# Altium schematic sheet PGS_3.SchDoc
size 381 x 241 mm; SheetNumber: 1; SheetTotal: 2
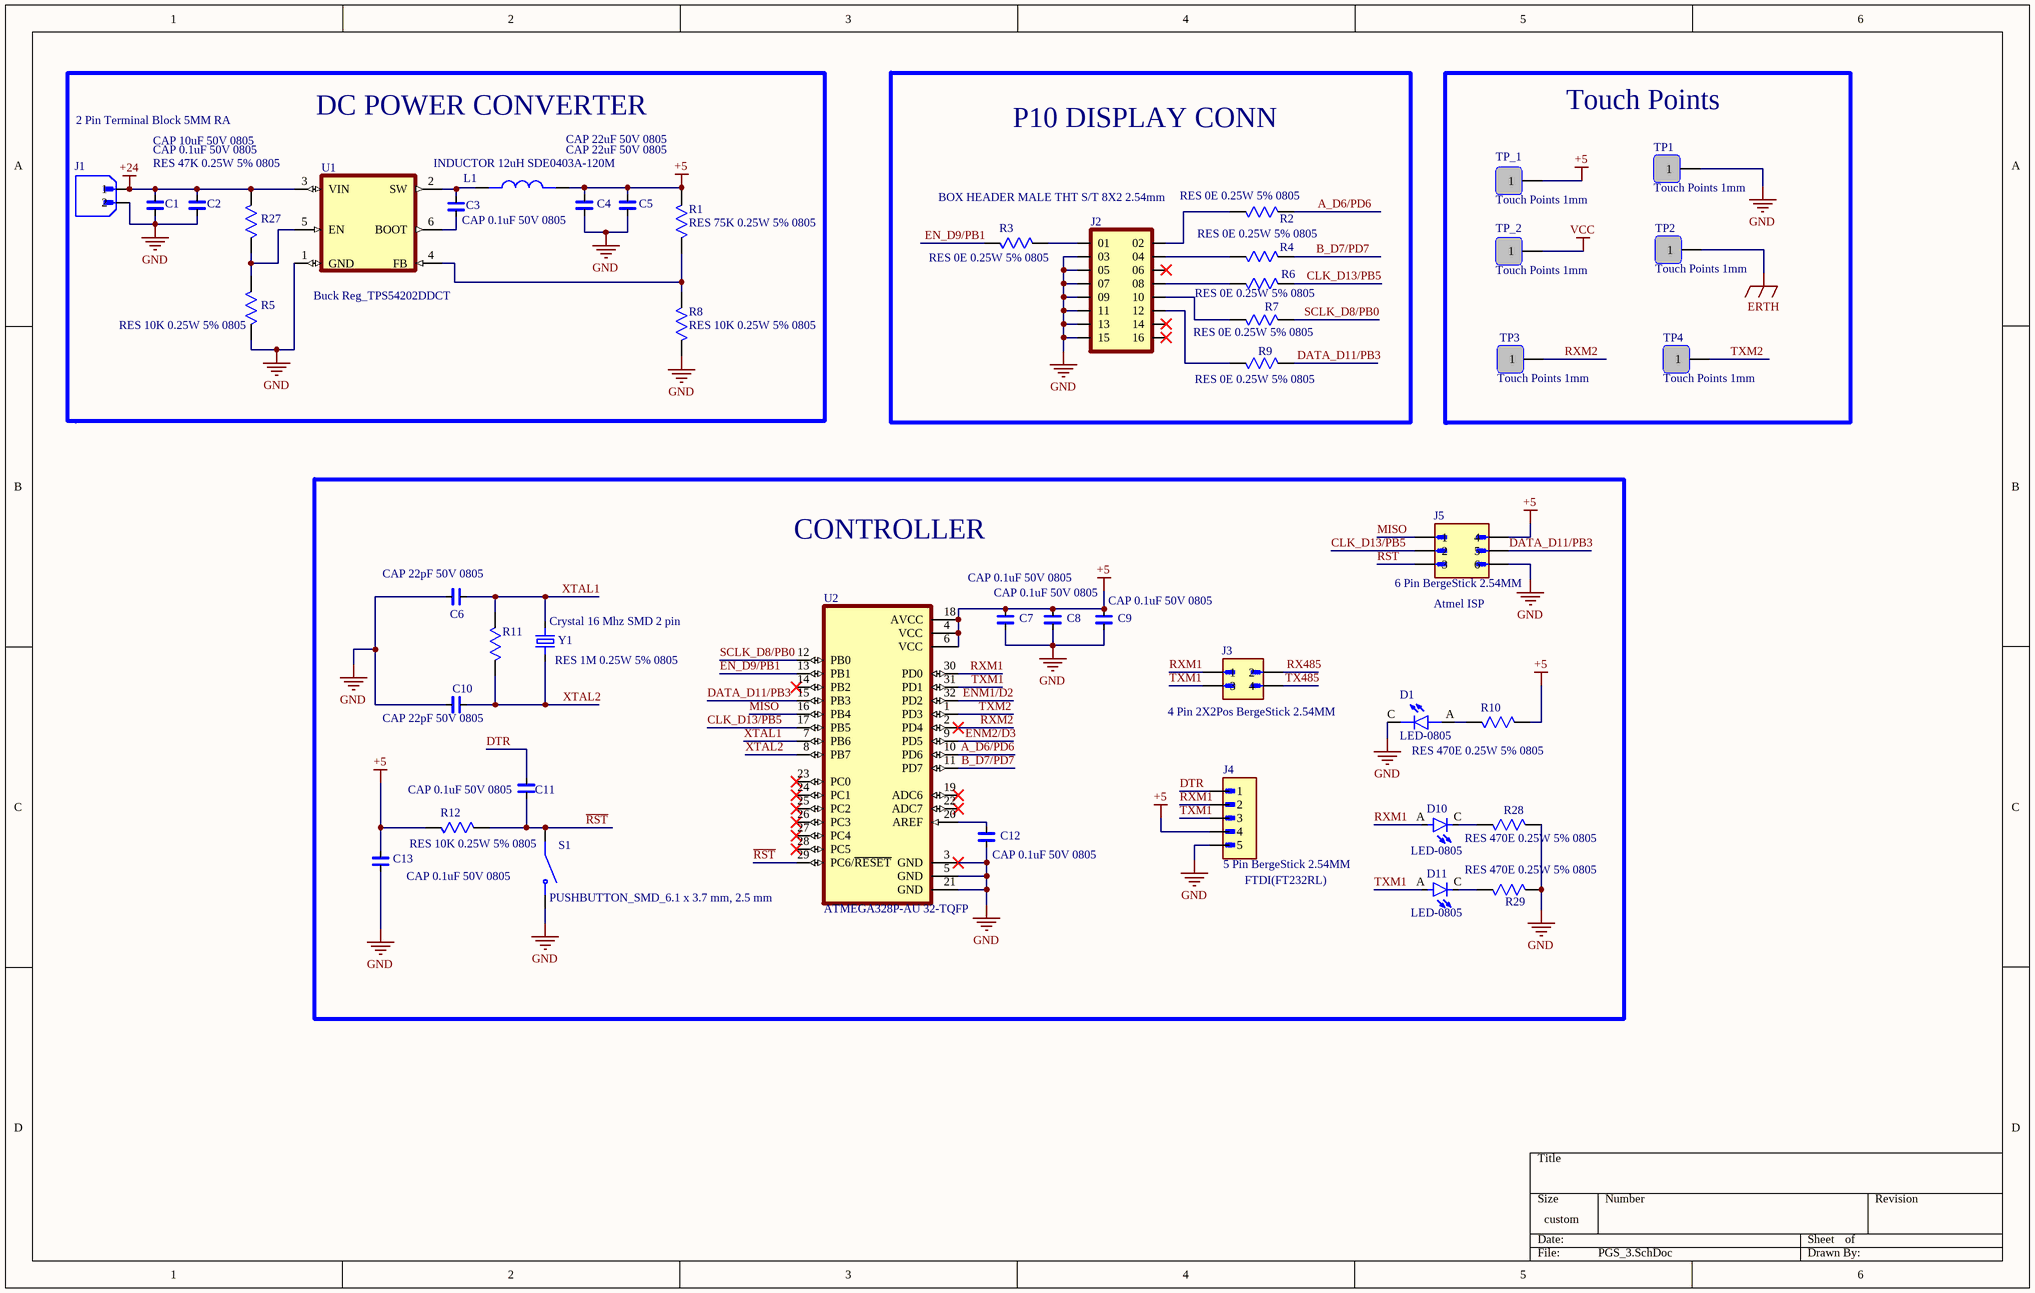
[diagram p0: PGS_3.SchDoc]

## Parts
C1  CAP 10uF 50V 0805  [CAP CER 0.1uF/50V 5%]
C2  CAP 0.1uF 50V 0805  [CAP CER 0.1uF/50V 5%]
C3  CAP 0.1uF 50V 0805  [CAP CER 0.1uF/50V 5%]
C4  CAP 22uF 50V 0805  [CAP CER 0.1uF/50V 5%]
C5  CAP 22uF 50V 0805  [CAP CER 0.1uF/50V 5%]
C6  CAP 22pF 50V 0805  [CAP CER 0.1uF/50V 5%]
C7  CAP 0.1uF 50V 0805  [CAP CER 0.1uF/50V 5%]
C8  CAP 0.1uF 50V 0805  [CAP CER 0.1uF/50V 5%]
C9  CAP 0.1uF 50V 0805  [CAP CER 0.1uF/50V 5%]
C10  CAP 22pF 50V 0805  [CAP CER 0.1uF/50V 5%]
C11  CAP 0.1uF 50V 0805  [CAP CER 0.1uF/50V 5%]
C12  CAP 0.1uF 50V 0805  [CAP CER 0.1uF/50V 5%]
C13  CAP 0.1uF 50V 0805  [CAP CER 0.1uF/50V 5%]
D1  LED-0805  [LED-0805]
D10  LED-0805  [LED-0805]
D11  LED-0805  [LED-0805]
J1  2 Pin Terminal Block 5MM RA  [2 Pin Terminal Block 5MM RA]
J2  BOX HEADER MALE THT S/T 8X2 2.54mm  [BOX HEADER MALE 8X2 2.54mm]
J3  4 Pin 2X2Pos BergeStick 2.54MM  [4 Pin BergeStick 2.54MM]
J4  5 Pin BergeStick 2.54MM  [5 Pin BergeStick 2.54MM]
J5  6 Pin BergeStick 2.54MM  [6 Pin BergeStick 2.54MM - duplicate]
L1  INDUCTOR 12uH SDE0403A-120M  [INDUCTOR 12uH SDE0403A-120M]
R1  RES 75K 0.25W 5% 0805  [RES 0805 10K/0.25W 5%]
R2  RES 0E 0.25W 5% 0805  [RES 0805 10K/0.25W 5%]
R3  RES 0E 0.25W 5% 0805  [RES 0805 10K/0.25W 5%]
R4  RES 0E 0.25W 5% 0805  [RES 0805 10K/0.25W 5%]
R5  RES 10K 0.25W 5% 0805  [RES 0805 10K/0.25W 5%]
R6  RES 0E 0.25W 5% 0805  [RES 0805 10K/0.25W 5%]
R7  RES 0E 0.25W 5% 0805  [RES 0805 10K/0.25W 5%]
R8  RES 10K 0.25W 5% 0805  [RES 0805 10K/0.25W 5%]
R9  RES 0E 0.25W 5% 0805  [RES 0805 10K/0.25W 5%]
R10  RES 470E 0.25W 5% 0805  [RES 0805 10K/0.25W 5%]
R11  RES 1M 0.25W 5% 0805  [RES 0805 10K/0.25W 5%]
R12  RES 10K 0.25W 5% 0805  [RES 0805 10K/0.25W 5%]
R27  RES 47K 0.25W 5% 0805  [RES 0805 10K/0.25W 5%]
R28  RES 470E 0.25W 5% 0805  [RES 0805 10K/0.25W 5%]
R29  RES 470E 0.25W 5% 0805  [RES 0805 10K/0.25W 5%]
S1  PUSHBUTTON_SMD_6.1 x 3.7 mm, 2.5 mm  [PUSHBUTTON_SMD_6.1 x 3.7 mm, 2.5 mm]
TP1  Touch Points 1mm  [Touch Points 1mm]
TP2  Touch Points 1mm  [Touch Points 1mm]
TP3  Touch Points 1mm  [Touch Points 1mm]
TP4  Touch Points 1mm  [Touch Points 1mm]
TP_1  Touch Points 1mm  [Touch Points 1mm]
TP_2  Touch Points 1mm  [Touch Points 1mm]
U1  Buck Reg_TPS54202DDCT  [Buck Reg_TPS54202DDCT]
U2  ATMEGA328P-AU 32-TQFP  [ATMEGA328P-AU 32-TQFP]
Y1  Crystal 16 Mhz SMD 2 pin  [Crystal 16 Mhz SMD 2 pin]

## Blocks framed on the sheet
DC POWER CONVERTER: C1-C5 J1 L1 R1 R5 R8 R27 U1
P10 DISPLAY CONN: J2 R2-R4 R6 R7 R9
Touch Points: TP1-TP4 TP_1 TP_2
CONTROLLER: C6-C13 D1 D10 D11 J3-J5 R10-R12 R28 R29 S1 U2 Y1

## Nets
+5: C4.2 C5.2 C7.2 C8.2 C9.2 C13.2 J4.4 J5.4 L1.2 R1.2 R10.2 R12.1 TP_1.1 U2.4(VCC) U2.6(VCC) U2.18(AVCC)
+24: C1.2 C2.2 J1.1 R27.2 U1.3(VIN)
ERTH: TP2.1
GND: C1.1 C2.1 C4.1 C5.1 C6.1 C7.1 C8.1 C9.1 C10.1 C12.1 C13.1 D1.C J1.2 J2.03 J2.05 J2.07 J2.09 J2.11 J2.13 J2.15 J4.5 J5.6 R5.1 R8.1 R28.2 R29.2 S1.2 TP1.1 U1.1(GND) U2.3(GND) U2.5(GND) U2.21(GND)
VCC: TP_2.1
A_D6/PD6: R2.2 U2.10(PD6)
B_D7/PD7: R4.2 U2.11(PD7)
CLK_D13/PB5: J5.2 R6.2 U2.17(PB5)
DATA_D11/PB3: J5.5 R9.2 U2.15(PB3)
DTR: C11.2 J4.1
EN_D9/PB1: R3.1 U2.13(PB1)
ENM1/D2: U2.32(PD2)
ENM2/D3: U2.9(PD5)
MISO: J5.1 U2.16(PB4)
~{RST}: C11.1 J5.3 R12.2 S1.1 U2.29(PC6/~{RESET})
RX485: J3.2
RXM1: D10.A J3.1 J4.2 U2.30(PD0)
RXM2: TP3.1 U2.2(PD4)
SCLK_D8/PB0: R7.2 U2.12(PB0)
TX485: J3.4
TXM1: D11.A J3.3 J4.3 U2.31(PD1)
TXM2: TP4.1 U2.1(PD3)
XTAL1: C6.2 R11.2 U2.7(PB6) Y1.2
XTAL2: C10.2 R11.1 U2.8(PB7) Y1.1
NetC3_1: C3.1 U1.6(BOOT)
NetC3_2: C3.2 L1.1 U1.2(SW)
NetC12_2: C12.2 U2.20(AREF)
NetD1_A: D1.A R10.1
NetD10_C: D10.C R28.1
NetD11_C: D11.C R29.1
NetJ2_01: J2.01 R3.2
NetJ2_02: J2.02 R2.1
NetJ2_04: J2.04 R4.1
NetJ2_08: J2.08 R6.1
NetJ2_10: J2.10 R7.1
NetJ2_12: J2.12 R9.1
NetR1_1: R1.1 R8.2 U1.4(FB)
NetR5_2: R5.2 R27.1 U1.5(EN)

Not connected (* = marked no-connect by the designer): J2 06* 14* 16*; U2 14(PB2)* 19(ADC6)* 22(ADC7)* 23(PC0)* 24(PC1)* 25(PC2)* 26(PC3)* 27(PC4)* 28(PC5)*

## Notes on the sheet
- (near J5) Atmel ISP
- (near J4) FTDI(FT232RL)

## Library data of the parts
C1-C13 = CAP CER 0.1uF/50V 5%: CAP CER 0.1uF/50V  Ceramic Capacitor X7R 0805 (2012 Metric); MF: Samsung; MP: CL21B104KCFNNNE; Purchase-URL: https://pricing.snapeda.com/search?q=CL21B104KCFNNNE&ref=eda; Package: 0805 Samsung; Check_prices: https://www.snapeda.com/parts/CL21B104KCFNNNE/Samsung+Electro-Mechanics/view-part/?ref=eda; Value: *; SnapEDA_Link: https://www.snapeda.com/parts/CL21B104KCFNNNE/Samsung+Electro-Mechanics/view-part/?ref=snap; Digi-Key_Part_Number: 1276-6840-2-ND
D1 = LED-0805: Red 640nm LED Indication - Discrete 1.85V 0805 (2012 Metric) APT2012SRCPRV; MF: Kingbright; SnapEDA_Link: https://www.snapeda.com/parts/APT2012SRCPRV/Kingbright/view-part/?ref=snap; Package: 0805 Kingbright; Value: *; MP: APT2012SRCPRV; Check_prices: https://www.snapeda.com/parts/APT2012SRCPRV/Kingbright/view-part/?ref=eda
D10 D11 = LED-0805: Red 640nm LED Indication - Discrete 1.85V 0805 (2012 Metric) SMT APT2012SRCPRV; MF: Kingbright; SnapEDA_Link: https://www.snapeda.com/parts/APT2012SRCPRV/Kingbright/view-part/?ref=snap; Package: 0805 Kingbright; Value: *; MP: APT2012SRCPRV; Check_prices: https://www.snapeda.com/parts/APT2012SRCPRV/Kingbright/view-part/?ref=eda
J1 = 2 Pin Terminal Block 5MM RA: 2 Pin Terminal Block HDR 5MM THT RA _OQ0271510000G; MF: Amphenol Anytek; SnapEDA_Link: https://www.snapeda.com/parts/OQ0271510000G/Amphenol/view-part/?ref=snap; Package: None; Value: *; MP: OQ0271510000G; Check_prices: https://www.snapeda.com/parts/OQ0271510000G/Amphenol/view-part/?ref=eda
J2 = BOX HEADER MALE THT S/T 8X2 2.54mm: THT BOX HEADER MALE S/T 8X2 2.54mm 16 pin; MP: TSS-108-01-T-D; Availability: Unavailable; Value: *; Price: None; Package: None
J3 = 4 Pin 2X2Pos BergeStick 2.54MM: 4 Pin 2X2Pos THT S/T BergeStick 2.54MM Amphenol 67997-104HLF 3A; MF: Amphenol ICC; Value: *; Package: None; Purchase-URL: https://pricing.snapeda.com/search/part/67997-104HLF/?ref=eda; Digi-Key_Part_Number: 609-3225-ND; Check_prices: https://www.snapeda.com/parts/67997-104HLF/Amphenol+FCI/view-part/?ref=eda; MP: 67997-104HLF; SnapEDA_Link: https://www.snapeda.com/parts/67997-104HLF/Amphenol+FCI/view-part/?ref=snap
J4 = 5 Pin BergeStick 2.54MM: 5 Pin 5Pos THT S/T BergeStick 2.54MM Amphenol68002-405HLF 3A; Package: None; Price: None; Value: *; MP: 68002-405HLF; Availability: Unavailable
J5 = 6 Pin BergeStick 2.54MM_1: 6 Pin 3X3Pos THT S/T BergeStick 2.54MM Amphenol 69192-406HLF; MF: AMPHENOL ICC / FCI; Package: None; Digi-Key_Part_Number: 609-4711-ND; Check_prices: https://www.snapeda.com/parts/69192-406HLF/Amphenol/view-part/?ref=eda; Value: *; MP: 69192-406HLF; Purchase-URL: https://pricing.snapeda.com/search/part/69192-406HLF/?ref=eda; SnapEDA_Link: https://www.snapeda.com/parts/69192-406HLF/Amphenol/view-part/?ref=snap
L1 = INDUCTOR 12uH SDE0403A-120M: INDUCTOR_2020(5.5mmX4.5mm)  SMT INDUCTOR 12uH SDE0403A-120M0 LQH5BPB4R7NT0L; Package: None; Price: None; Value: *; MP: LQH5BPB4R7NT0L; Availability: Unavailable
R1-R12 R27 = RES 10K 0.25W 5% 0805: RESISTOR, THICK FILM, 10K, 5%, 0805 0.25W; MP: ERJ-6GEYJ103V; MF: Panasonic Electronic; Price: None; Check_prices: https://www.snapeda.com/parts/ERJ-6GEYJ103V/Panasonic+Electronic+Components/view-part/?ref=eda; Package: 805-2 Panasonic; Purchase-URL: https://pricing.snapeda.com/search/part/ERJ-6GEYJ103V/?ref=eda; Availability: In Stock; SnapEDA_Link: https://www.snapeda.com/parts/ERJ-6GEYJ103V/Panasonic+Electronic+Components/view-part/?ref=snap; Value: *
R28 R29 = RES 10K 0.25W 5% 0805: RESISTOR, THICK FILM, 10K, 5%, 0805 0.25W SMT; MP: ERJ-6GEYJ103V; MF: Panasonic Electronic; Price: None; Check_prices: https://www.snapeda.com/parts/ERJ-6GEYJ103V/Panasonic+Electronic+Components/view-part/?ref=eda; Package: 805-2 Panasonic; Purchase-URL: https://pricing.snapeda.com/search/part/ERJ-6GEYJ103V/?ref=eda; Availability: In Stock; SnapEDA_Link: https://www.snapeda.com/parts/ERJ-6GEYJ103V/Panasonic+Electronic+Components/view-part/?ref=snap; Value: *
S1 = PUSHBUTTON_SMD_6.1 x 3.7 mm, 2.5 mm: 6.1 x 3.7 mm, 2.5 mm Actuator Height, 260 gf, Red, Surface Mount, SPST, Tactile Switch, TS09-63-25-R-260-SMT-TR; MF: Same Sky; SnapEDA_Link: https://www.snapeda.com/parts/TS09-63-25-R-260-SMT-TR/Same+Sky/view-part/?ref=snap; Package: None; Value: *; MP: TS09-63-25-R-260-SMT-TR; Check_prices: https://www.snapeda.com/parts/TS09-63-25-R-260-SMT-TR/Same+Sky/view-part/?ref=eda
TP1-TP4 TP_1 TP_2 = Touch Points: Touch Points 0.75mm to1mm
U1 = TPS54202DDCT: 4.5V to 28V Input, 2A Output, EMI Friendly Synchronous Step-Down Converter TPS54202DDCT; MF: Texas Instruments; SnapEDA_Link: https://www.snapeda.com/parts/TPS54202DDCT/Texas+Instruments/view-part/?ref=snap; Package: SOT-23-THN-6 Texas Instruments; Value: *; MP: TPS54202DDCT; Check_prices: https://www.snapeda.com/parts/TPS54202DDCT/Texas+Instruments/view-part/?ref=eda
U2 = ATMEGA328P-AU_1: AVR AVRÂ® ATmega Microcontroller IC 8-Bit 20MHz 32KB (16K x 16) FLASH 32-TQFP (7x7); MF: Microchip; SnapEDA_Link: https://www.snapeda.com/parts/ATMEGA328P-AU/Microchip/view-part/?ref=snap; Package: TQFP-32 Microchip; Value: *; MP: ATMEGA328P-AU; Check_prices: https://www.snapeda.com/parts/ATMEGA328P-AU/Microchip/view-part/?ref=eda
Y1 = Crystal 16 Mhz SMD 2 pin_1: 16 MHz Â±30ppm Crystal 20pF 60 Ohms HC-49/US FOXSDLF/128-20 16 Mhz Crystal SMD –CSM-4ALX(28ALX) 12.5mmX4.85mmX4mm; MF: Fox Electronics; SnapEDA_Link: https://www.snapeda.com/parts/FOXSDLF/128-20/Fox+Electronics/view-part/?ref=snap; Package: HC49SD Fox Electronics; Value: *; MP: FOXSDLF/128-20; Check_prices: https://www.snapeda.com/parts/FOXSDLF/128-20/Fox+Electronics/view-part/?ref=eda